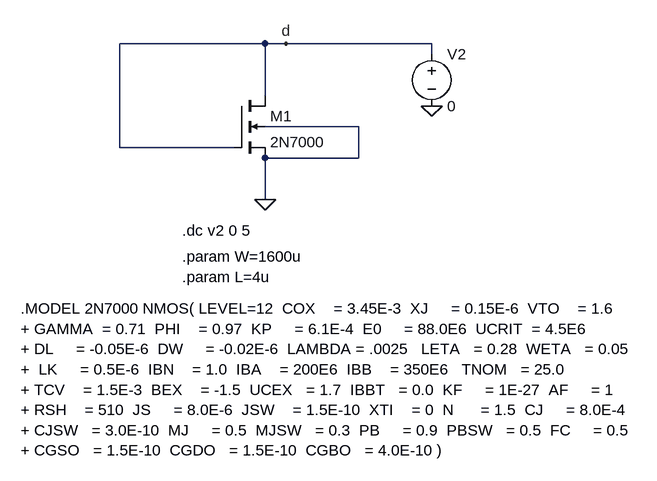
[diagram p0: schematic 2n7000_ekv_VT_KN.asc]
2n7000_ekv_VT_KN.asc, the LTspice schematic file:
Version 4
SHEET 1 2092 1428
WIRE 384 80 160 80
WIRE 416 80 384 80
WIRE 640 80 416 80
WIRE 640 96 640 80
WIRE 384 160 384 80
WIRE 528 208 384 208
WIRE 160 240 160 80
WIRE 336 240 160 240
WIRE 528 256 528 208
WIRE 528 256 384 256
WIRE 384 320 384 256
FLAG 640 176 0
FLAG 416 80 d
FLAG 384 320 0
SYMBOL nmos4 336 160 R0
SYMATTR InstName M1
SYMATTR Value2 l={L} w={W}
SYMATTR Value 2N7000
SYMBOL voltage 640 80 R0
WINDOW 123 0 0 Left 2
WINDOW 39 0 0 Left 2
SYMATTR InstName V2
SYMATTR Value 0
TEXT 8 488 Left 2 !.MODEL 2N7000 NMOS( LEVEL=12  COX    = 3.45E-3  XJ     = 0.15E-6  VTO    = 1.6\n+ GAMMA  = 0.71  PHI    = 0.97  KP     = 6.1E-4  E0     = 88.0E6  UCRIT  = 4.5E6 \n+ DL     = -0.05E-6  DW     = -0.02E-6  LAMBDA = .0025   LETA   = 0.28  WETA   = 0.05 \n+  LK     = 0.5E-6  IBN    = 1.0  IBA    = 200E6  IBB    = 350E6   TNOM   = 25.0 \n+ TCV    = 1.5E-3  BEX    = -1.5  UCEX   = 1.7  IBBT   = 0.0  KF     = 1E-27  AF     = 1 \n+ RSH    = 510  JS     = 8.0E-6  JSW    = 1.5E-10  XTI    = 0  N      = 1.5  CJ     = 8.0E-4 \n+ CJSW   = 3.0E-10  MJ     = 0.5  MJSW   = 0.3  PB     = 0.9  PBSW   = 0.5  FC     = 0.5 \n+ CGSO   = 1.5E-10  CGDO   = 1.5E-10  CGBO   = 4.0E-10 )
TEXT 256 368 Left 2 !.dc v2 0 5
TEXT 256 408 Left 2 !.param W=1600u\n.param L=4u

The netlist it stands for:
* 2n7000_ekv_VT_KN.asc
M1 d d 0 0 2N7000 l={L} w={W}
V2 d 0 0
.model NMOS NMOS
.model PMOS PMOS
.lib standard.mos
.MODEL 2N7000 NMOS( LEVEL=12  COX    = 3.45E-3  XJ     = 0.15E-6  VTO    = 1.6
+ GAMMA  = 0.71  PHI    = 0.97  KP     = 6.1E-4  E0     = 88.0E6  UCRIT  = 4.5E6
+ DL     = -0.05E-6  DW     = -0.02E-6  LAMBDA = .0025   LETA   = 0.28  WETA   = 0.05
+  LK     = 0.5E-6  IBN    = 1.0  IBA    = 200E6  IBB    = 350E6   TNOM   = 25.0
+ TCV    = 1.5E-3  BEX    = -1.5  UCEX   = 1.7  IBBT   = 0.0  KF     = 1E-27  AF     = 1
+ RSH    = 510  JS     = 8.0E-6  JSW    = 1.5E-10  XTI    = 0  N      = 1.5  CJ     = 8.0E-4
+ CJSW   = 3.0E-10  MJ     = 0.5  MJSW   = 0.3  PB     = 0.9  PBSW   = 0.5  FC     = 0.5
+ CGSO   = 1.5E-10  CGDO   = 1.5E-10  CGBO   = 4.0E-10 )
.dc v2 0 5
.param W=1600u
.param L=4u
.backanno
.end